# Altium schematic sheet 06_Relays_and_SolenoidValves.SchDoc
size A4; Engineer: Juan Rafael Munoz, Jr.; DocumentNumber: 6; SheetNumber: 6; SheetTotal: 7
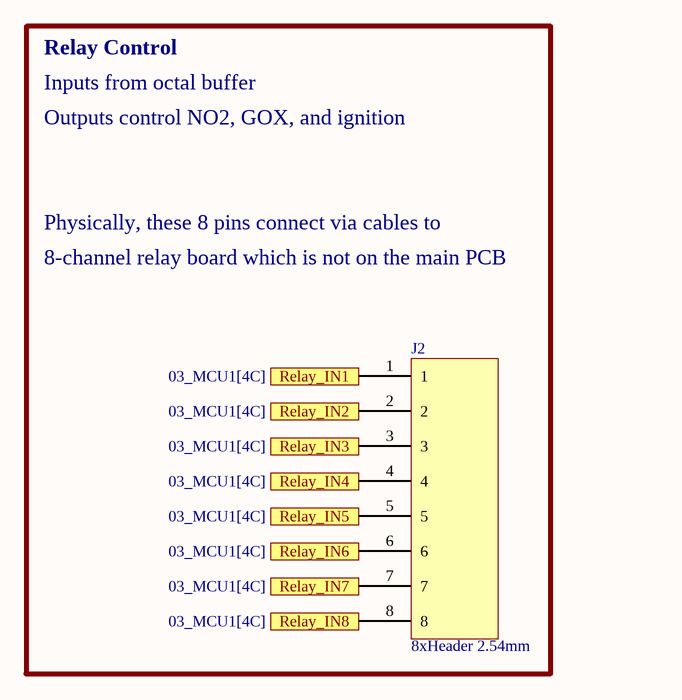
[diagram p0: 06_Relays_and_SolenoidValves.SchDoc]

## Parts
J2  8xHeader 2.54mm  [1x8HeaderPins]

## Ports
Relay_IN1 (in, see 03_MCU1[4C]), Relay_IN2 (in, see 03_MCU1[4C]), Relay_IN3 (in, see 03_MCU1[4C]), Relay_IN4 (in, see 03_MCU1[4C]), Relay_IN5 (in, see 03_MCU1[4C]), Relay_IN6 (in, see 03_MCU1[4C]), Relay_IN7 (in, see 03_MCU1[4C]), Relay_IN8 (in, see 03_MCU1[4C])

## Nets
Relay_IN1: J2.1 ; port Relay_IN1
Relay_IN2: J2.2 ; port Relay_IN2
Relay_IN3: J2.3 ; port Relay_IN3
Relay_IN4: J2.4 ; port Relay_IN4
Relay_IN5: J2.5 ; port Relay_IN5
Relay_IN6: J2.6 ; port Relay_IN6
Relay_IN7: J2.7 ; port Relay_IN7
Relay_IN8: J2.8 ; port Relay_IN8

## Notes on the sheet
- Relay Control
- Inputs from octal buffer
- Outputs control NO2, GOX, and ignition
- Physically, these 8 pins connect via cables to
- 8-channel relay board which is not on the main PCB
- Title:
- Company:
- Date:
- Sheet
- of
- Drawn By: